# EasyEDA Pro project ProProject_Acho.epro, board PCB3
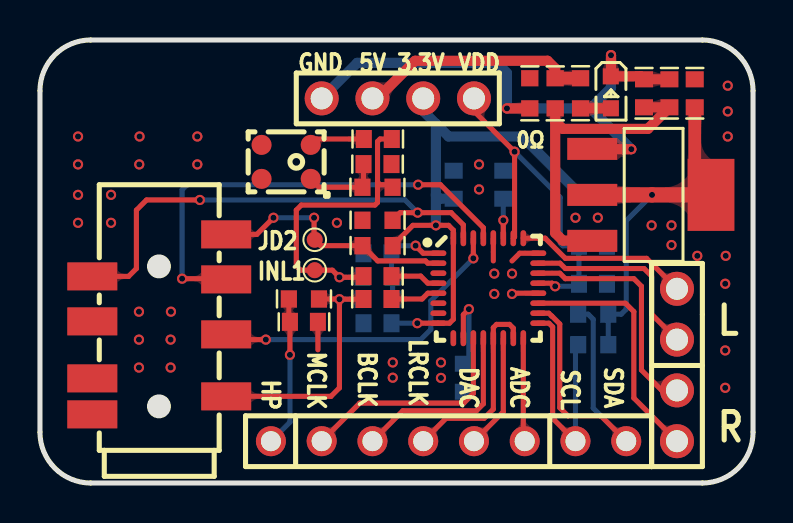
[diagram p2: board, top side]
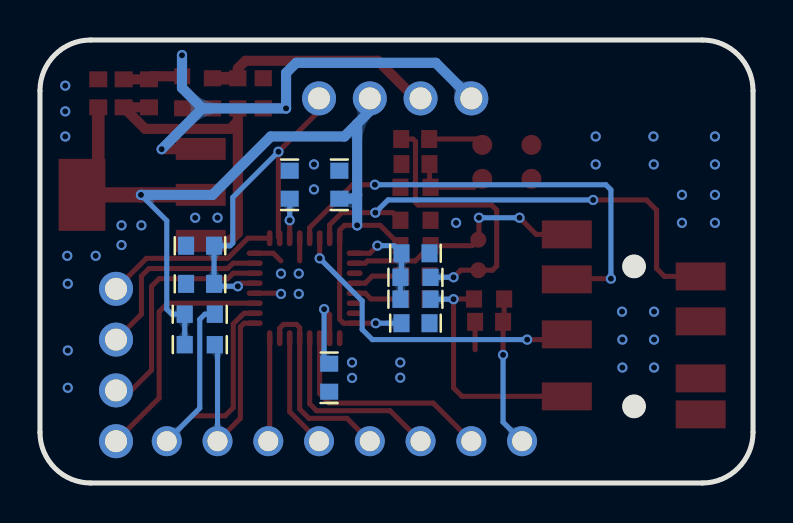
[diagram p3: board, bottom side, seen from below]

Outline 35.68 x 22.16 mm; copper layers: Top Layer, Bottom Layer. Coordinates in mm from the lower left corner of the outline.
Outline path: 0,19.62 0,2.54 arc(0.74,0.74) 2.54,0 33.14,0 arc(34.94,0.74) 35.68,2.54 35.68,19.62 arc(34.94,21.41) 33.14,22.16 2.54,22.16 arc(0.74,21.41) 0,19.62
Stack: Top Layer 0.035mm - / Dielectric1 1.51mm FR4 er 4.5 / Bottom Layer 0.035mm -

## Design rules (mm)
template: 自定义配置
spacing copperThickness1oz (default): track to track 0.102, other pairs 0.152 to 0.3
spacing copperThickness2oz: track to track 0.203, other pairs 0.152 to 0.3
track width copperThickness1oz (default): min 0.127, default 0.254, max 2.54
track width copperThickness2oz: min 0.203, default 0.254, max 2.54
differential pair differentialPair (default): width min 0.127, default 0.254, max 2.54; gap min 0.152, default 0.152
via viaSize: diameter min 0.5, default 0.61, max 10; hole min 0.3, default 0.305, max 6.3
via viaSize_tiny (default): diameter min 0.5, default 0.51, max 10; hole min 0.3, default 0.305, max 6.3

## Placement (name value [footprint] x y rotation side)
C1  100nF  [C0603]  20.7 14.92 90 bottom
C2  10uF  [C0603]  23.19 14.92 90 bottom
C3  10uF  [C0603]  27.67 9.96 180 bottom
C4  10uF  [C0603]  16.89 11.49 180 bottom
C5  100nF  [C0603]  27.67 11.87 180 bottom
C6  1uF  [C0603]  16.89 9.2 0 top
C7  1uF  [C0603]  16.89 10.35 0 top
C8  100nF  [C0603]  13.21 8.06 180 top
C9  100nF  [C0603]  16.89 7.99 180 bottom
C10  100nF  [C0603]  21.21 5.27 90 bottom
C11  100nF  [C0603]  31.5 19.49 270 top
C12  10uF  [C0603]  30.23 19.49 270 top
C13  10uF  [C0603]  32.77 19.49 270 top
C14  100nF  [C0603]  16.89 15.95 180 top
C15  1uF  [C0603]  16.91 17.2 0 top
CN1  PJ-393  [AUDIO-TH_PJ-393]  5.97 7.93 180 top
H1  -  [HDR-TH_8P-P2.54-V-M]  20.45 2.09 180 top
H3  -  [HDR-TH_4P-P2.54-V-M]  17.91 19.24 0 top
H4  -  [HDR-TH_4P-P2.54-V-M]  31.88 5.9 270 top
LED1  -  [LED_0603]  28.57 19.49 270 top
MIC1  AOS3729A-T42-NXC  [MIC-SMD_L3.8-W3.00-TL]  12.32 16.06 270 top
R1  2.2K  [R0603]  16.89 9.19 0 bottom
R2  2.2K  [R0603]  16.89 10.29 0 bottom
R3  10K  [R0603]  27.69 8.44 0 bottom
R4  10K  [R0603]  13.21 9.2 0 top
R5  10K  [R0603]  27.69 6.92 180 bottom
R6  0  [R0603]  24.51 19.49 270 top
R7  0  [R0603]  25.78 19.49 270 top
R8  10K  [R0603]  27.05 19.49 90 top
R9  47K  [R0603]  16.89 11.87 0 top
R10  15K  [R0603]  16.89 14.79 180 top
R11  10K  [R0603]  16.89 13.14 0 top
U1  WM8960CGEFL/RV  [QFN-32_L5.0-W5.0-P0.50-TL-EP3.5]  22.44 9.74 0 top
U2  AMS1117-3.3  [SOT-223-3_L6.5-W3.4-P2.30-LS7.0-BR]  30.61 14.41 180 top
U3  -  [测试点0.8mm]  13.75 12.17 90 top
U4  -  [测试点0.8mm]  13.75 10.64 90 top

## Footprints (pads in the part's own frame, mm; a bottom-side part is the same pattern mirrored in y, then rotated)
AUDIO-TH_PJ-393
  rect 2.5x1.4 smd: 1(-3.35,3.6) 2(3.35,-2.4) 3(-3.35,-2.25) 4(-3.35,0.5) 5(-3.35,-4.5) 6(3.35,-0.15) 7(3.35,2.7) 8(3.35,4.5)
C0603
  rect 0.8x0.9 smd: 1(-0.7,0) 2(0.7,0)
HDR-TH_4P-P2.54-V-M
  round 1.7 hole 1.1: 1(-3.81,0) 2(-1.27,0) 3(1.27,0) 4(3.81,0)
HDR-TH_8P-P2.54-V-M
  round 1.5 hole 1: 1(-8.89,0) 2(-6.35,0) 3(-3.81,0) 4(-1.27,0) 5(1.27,0) 6(3.81,0) 7(6.35,0) 8(8.89,0)
LED_0603
  rect 0.8x0.8 smd: 1(-0.851,-0.01) 2(0.75,-0.005)
MIC-SMD_L3.8-W3.00-TL
  round 1 smd: 1(0.85,1.23) 2(0.85,-1.23) 3(-0.85,-1.23) 4(-0.85,1.23)
QFN-32_L5.0-W5.0-P0.50-TL-EP3.5
  oval 0.8x0.28 smd: 1(-2.5,1.75) 2(-2.5,1.25) 3(-2.5,0.75) 4(-2.5,0.25) 5(-2.5,-0.25) 6(-2.5,-0.75) 7(-2.5,-1.25) 8(-2.5,-1.75) 17(2.5,-1.75) 18(2.5,-1.25) 19(2.5,-0.75) 20(2.5,-0.25) 21(2.5,0.25) 22(2.5,0.75) 23(2.5,1.25) 24(2.5,1.75)
  oval 0.28x0.8 smd: 9(-1.75,-2.5) 10(-1.25,-2.5) 11(-0.75,-2.5) 12(-0.25,-2.5) 13(0.25,-2.5) 14(0.75,-2.5) 15(1.25,-2.5) 16(1.75,-2.5) 25(1.75,2.5) 26(1.25,2.5) 27(0.75,2.5) 28(0.25,2.5) 29(-0.25,2.5) 30(-0.75,2.5) 31(-1.25,2.5) 32(-1.75,2.5)
R0603
  rect 0.806x0.864 smd: 1(-0.753,0) 2(0.753,0)
SOT-223-3_L6.5-W3.4-P2.30-LS7.0-BR
  rect 2.5x1.1 smd: 1(2.97,-2.3) 2(2.97,0) 3(2.97,2.3)
  rect 2.34x3.6 smd: 4(-2.97,0)
测试点0.8mm
  round 0.8 smd: 1(0,0)

## Nets
AGND: C1.2 C2.2 C3.1 C4.2 C5.1 C8.1 C9.2 C10.1 C13.1 C14.1 MIC1.2 MIC1.3 R6.1 R11.1 U1.9 U1.20 U1.24 U1.28
GND: C11.1 C12.1 H3.1 LED1.1 R6.2 U2.1
VCC3.3V: C1.1 C9.1 C13.2 H3.3 R3.2 R5.1 R9.2 U1.8 U1.32 U2.2 U2.4
VCC5V: H3.2 R7.1 R8.2
VDD: C3.2 C5.2 H3.4 U1.21 U1.26
HP_ADC: C8.2 H1.8 R4.1
HP_GND: CN1.4 U1.30
HP_L: CN1.2 R11.2 U1.31
HP_R: CN1.3 U1.29
I2C_SCL: H1.2 R5.2 U1.17
I2C_SDA: H1.1 R3.1 U1.18
I2S_ADC: H1.3 U1.16
I2S_CLK: H1.6 U1.12
I2S_DAC: H1.4 U1.14
I2S_LRCLK: H1.5 U1.13 U1.15
I2S_MCLK: H1.7 U1.11
INPUT_L1: C7.1 C15.2 R2.1 R10.1 U4.1
INPUT_R1: C6.1 CN1.1 R1.1 R4.2
JD2_L3: CN1.5 R9.1 U1.2 U3.1
SPK_LN: H4.2 U1.23
SPK_LP: H4.1 U1.25
SPK_RN: H4.4 U1.19
SPK_RP: H4.3 U1.22
$1N1430: C4.1 R1.2 R2.2 U1.1
$1N1486: C6.2 U1.5
$1N1720: C15.1 MIC1.4
$1N1861: C14.2 MIC1.1 R10.2
$1N2778: C2.1 U1.27
$1N2971: C10.2 U1.10
$1N3308: C11.2 C12.2 R7.2 U2.3
$1N3734: C7.2 U1.4
$1N4627: LED1.2 R8.1

Pads without a net: CN1 6 7 8; U1 3 6 7

## Via types
v1: diameter 0.51, hole 0.305, Top Layer to Bottom Layer, 62 vias

## Routing (per net, layer and track width the routed paths; a pad name or vN(x,y) marks a point on that pad's centre or on a via; arc(x,y) is an arc through that point)
AGND: length 5.3
  Top Layer w0.254: v1(23.62,9.46) 23.66,9.49 U1.20 ; U1.28 22.69,11.11 ; U1.24 24.01,11.49 23.62,11.11 ; C8.1 13.91,6.66
  vias: v1(1.91,17.33) v1(1.91,15.93) v1(1.91,14.41) v1(1.91,13.01) v1(3.56,14.41) v1(3.56,13.01) v1(4.95,8.57) v1(4.95,7.17) v1(4.95,5.77) v1(4.98,17.33) v1(4.97,15.93) v1(6.55,8.57) v1(6.54,7.17) v1(6.54,5.77) v1(7.87,17.33) v1(7.87,15.93) v1(14.86,13.01) v1(17.65,6.03) v1(17.65,5.27) v1(20.07,6.03) v1(20.07,5.26) v1(21.97,15.93) v1(21.97,14.68) v1(22.73,10.47) v1(22.73,9.46) v1(23.62,10.47) v1(26.8,13.27) v1(27.92,13.27) v1(30.61,12.89) v1(31.6,12.89) v1(31.6,11.9) v1(32.89,11.36) v1(34.32,11.36) v1(34.29,9.97) v1(34.29,6.63) v1(34.29,4.76) v1(34.42,19.87) v1(34.42,18.59) v1(34.42,17.33)
GND: length 29.3
  Top Layer w0.508: R6.2 v1(23.37,18.74) ; v1(28.57,21.4) 28.57,20.35 LED1.1 30.07,20.34 C12.1 C11.1 ; v1(29.59,16.7) 27.65,16.7 U2.1
  Bottom Layer w0.508: 27.55,18.74 28.57,19.76 v1(28.57,21.4) ; 27.55,18.74 v1(23.37,18.74) 23.37,20.51 22.86,21.02 15.88,21.02 H3.1 ; 27.55,18.74 v1(29.59,16.7)
VCC3.3V: length 50.5
  Top Layer w0.254: v1(18.88,7.99) U1.8 20.49,7.99 20.69,8.19 U1.32 20.69,12.65 20.45,12.89 v1(19.81,12.89) 18.66,12.89 R9.2
  Top Layer w0.635: C13.2 32.77,15.22 U2.4
  Top Layer w0.762: U2.2 v1(30.63,14.41) U2.4
  Bottom Layer w0.254: v1(18.88,7.99) C9.1 ; R5.1 R3.2 29.08,8.44 29.34,8.7 29.34,13.12 v1(30.63,14.41)
  Bottom Layer w0.508: 19.81,17.97 19.81,14.41 ; 19.81,17.97 20.45,17.33 24.13,17.33 27.05,14.41 v1(30.63,14.41) ; 19.81,17.97 19.18,18.6 H3.3 ; 19.81,14.41 20,14.22 C1.1 ; 19.81,14.41 v1(19.81,12.89)
VCC5V: length 11.8
  Top Layer w0.508: R7.1 25.78,20.74 25.4,21.12 18.77,21.12 16.89,19.24 H3.2
  Top Layer w0.635: R7.1 R8.2
VDD: length 18.4
  Top Layer w0.254: v1(25.78,9.84) 25.63,9.99 U1.21 ; U1.26 23.75,12.31 v1(23.75,16.57) 21.72,18.6 H3.4
  Bottom Layer w0.254: v1(23.75,16.57) 26.03,14.28 26.03,12 26.17,11.87 C5.2 C3.2 26.85,9.84 v1(25.78,9.84)
HP_ADC: length 7.5
  Top Layer w0.254: R4.1 12.45,8.11 C8.2 v1(12.51,6.41)
  Bottom Layer w0.254: H1.8 12.51,3.04 v1(12.51,6.41)
HP_GND: length 16
  Top Layer w0.254: CN1.4 9.58,7.17 v1(11.3,7.17) ; U1.30 v1(21.69,11.24)
  Bottom Layer w0.254: v1(11.3,7.17) 19.05,7.17 19.56,7.68 19.56,9.11 v1(21.69,11.24)
HP_L: length 24.5
  Top Layer w0.254: U1.31 21.19,12.91 20.57,13.52 v1(18.9,13.52) 18.03,13.52 R11.2 ; 2.62,10.33 4.43,10.33 4.83,10.73 4.83,13.65 5.33,14.16 v1(8,14.16)
  Bottom Layer w0.254: v1(8,14.16) 18.26,14.16 v1(18.9,13.52)
HP_R: length 23.3
  Top Layer w0.254: U1.29 22.19,12.77 20.04,14.92 v1(18.92,14.92) ; CN1.3 9.28,10.22 v1(7.11,10.22)
  Bottom Layer w0.254: v1(18.92,14.92) 7.37,14.92 7.11,14.66 v1(7.11,10.22)
I2C_SCL: length 11.9
  Top Layer w0.254: U1.17 25.47,7.99 25.65,7.81 25.65,3.23 H1.2
  Bottom Layer w0.254: H1.2 26.8,6.78 R5.2
I2C_SDA: length 17.1
  Top Layer w0.254: U1.18 25.46,8.49 25.61,8.35 25.62,8.35 26.01,7.95 26.01,3.77 26.42,3.36 28.07,3.36 H1.1
  Bottom Layer w0.254: H1.1 27.69,3.74 27.69,8.19 27.43,8.44 R3.1
I2S_ADC: length 5.2
  Top Layer w0.254: H1.3 24.19,2.16 U1.16
I2S_CLK: length 9.6
  Top Layer w0.254: H1.6 18.16,3.62 21.84,3.62 22.19,3.96 U1.12
I2S_DAC: length 5.8
  Top Layer w0.254: H1.4 23.19,3.56 U1.14
I2S_LRCLK: length 9.9
  Top Layer w0.254: H1.5 20.32,3.23 22.22,3.23 22.69,3.7 U1.13 22.69,7.77 22.85,7.93 23.5,7.93 23.69,7.74 U1.15
I2S_MCLK: length 11.3
  Top Layer w0.254: U1.11 21.69,4.47 21.21,4 16,4 H1.7
INPUT_L1: length 16.5
  Top Layer w0.254: 16.89,15.05 16.89,17.08 17.02,17.2 C15.2 ; 16.89,15.05 17.02,14.92 17.52,14.92 R10.1 ; 16.89,15.05 16.89,14.03 16.76,13.9 13.08,13.9 12.83,13.65 12.83,10.86 13.04,10.64 U4.1 14.63,10.64 v1(14.99,10.29) 16.13,10.29 C7.1
  Bottom Layer w0.254: R2.1 v1(14.99,10.29)
INPUT_R1: length 13.7
  Top Layer w0.254: v1(14.99,9.19) 14.97,9.2 R4.2 ; v1(14.99,9.19) 16.18,9.19 C6.1 ; v1(14.99,9.19) 14.99,4.76 14.56,4.33 9.32,4.33
  Bottom Layer w0.254: R1.1 v1(14.99,9.19)
JD2_L3: length 12.5
  Top Layer w0.254: U1.2 19.41,10.99 19.29,11.11 16.9,11.11 R9.1 14.05,11.87 U3.1 13.72,12.2 v1(13.72,13.27) ; CN1.5 10.85,12.43 v1(11.68,13.27)
  Bottom Layer w0.254: v1(11.68,13.27) v1(13.72,13.27)
SPK_LN: length 9.6
  Top Layer w0.254: H4.2 30.61,8.44 30.61,10.35 30.23,10.73 26.29,10.73 26.02,10.99 U1.23
SPK_LP: length 8.7
  Top Layer w0.254: H4.1 30.35,11.24 26.29,11.24 25.28,12.24 U1.25
SPK_RN: length 12.3
  Top Layer w0.254: U1.19 29.29,8.99 29.72,8.57 29.72,4.25 H4.4
SPK_RP: length 11.8
  Top Layer w0.254: H4.3 31.12,4.63 30.1,5.65 30.1,9.84 29.72,10.22 26.29,10.22 26.02,10.49 U1.22
$1N1430: length 5
  Top Layer w0.254: v1(18.8,11.87) 19.17,11.49 U1.1
  Bottom Layer w0.254: v1(18.8,11.87) 17.97,11.87 C4.1 17.59,10.34 R2.2 R1.2
$1N1486: length 2.5
  Top Layer w0.254: U1.5 19.41,9.49 19.12,9.2 C6.2
$1N1720: length 2.8
  Top Layer w0.254: C15.1 13.84,17.2 MIC1.4
$1N1861: length 3.9
  Top Layer w0.254: MIC1.1 13.97,14.79 R10.2 16.19,14.85 C14.2
$1N2778: length 2
  Top Layer w0.254: v1(23.19,13.14) U1.27
  Bottom Layer w0.254: C2.1 v1(23.19,13.14)
$1N2971: length 4.4
  Top Layer w0.254: v1(21.46,8.7) 21.19,8.42 U1.10
  Bottom Layer w0.254: v1(21.46,8.7) 21.46,6.22 C10.2
$1N3308: length 15.8
  Top Layer w0.508: 25.78,18.09 25.78,12.51 26.16,12.12 27.62,12.12 U2.3 ; 25.78,18.09 R7.2 ; 25.78,18.09 26.16,17.71 30.42,17.71 C11.2 C12.2
$1N3734: length 2.5
  Top Layer w0.254: U1.4 19.41,9.99 19.06,10.35 C7.2
$1N4627: length 1.5
  Top Layer w0.508: LED1.2 27.06,18.74 R8.1

## Copper pours and planes (outline as drawn; the poured copper is in the pictures)
AGND on Top Layer: -0.52,23.3 36.19,23.3 36.19,-0.83 -0.52,-0.83
AGND on Bottom Layer: -0.63,23.3 36.7,23.3 36.7,-1.21 -0.63,-1.21

Small or netless copper shapes (teardrops, artwork), in the pictures only: 114 on Top Layer, 46 on Bottom Layer

## Text on the board
Top Solder Mask Layer: Created By JasomWu | WM8960-AUDIO
Top Silkscreen Layer: 0Ω | HP | MCLK | BCLK | LRCLK | DAC | ADC | SCL | SDA | GND | 5V | 3.3V | VDD | JD2 | INL1 | L | R
